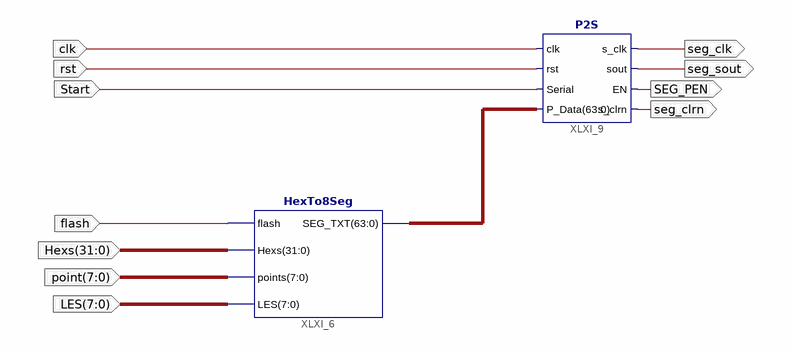
[diagram p0: schematic sheet 1]
// Xilinx ISE schematic Display.sch (kintex7) as structural Verilog: 2 symbols, 11 ports
module Display (
  input  flash,
  input  [31:0] Hexs,
  input  [7:0] point,
  input  [7:0] LES,
  input  clk,
  input  rst,
  input  Start,
  output seg_clk,
  output seg_sout,
  output SEG_PEN,
  output seg_clrn
);

  wire [63:0] XLXN_37;

  HexTo8Seg XLXI_6 (.flash(flash), .Hexs(Hexs), .points(point), .LES(LES), .SEG_TXT(XLXN_37));
  P2S XLXI_9 (
    .s_clrn(seg_clrn), .sout(seg_sout), .rst(rst), .EN(SEG_PEN), .Serial(Start), .clk(clk), .s_clk(seg_clk),
    .P_Data(XLXN_37));
endmodule
